# Altium schematic sheet sheet_top.SchDoc
size A4
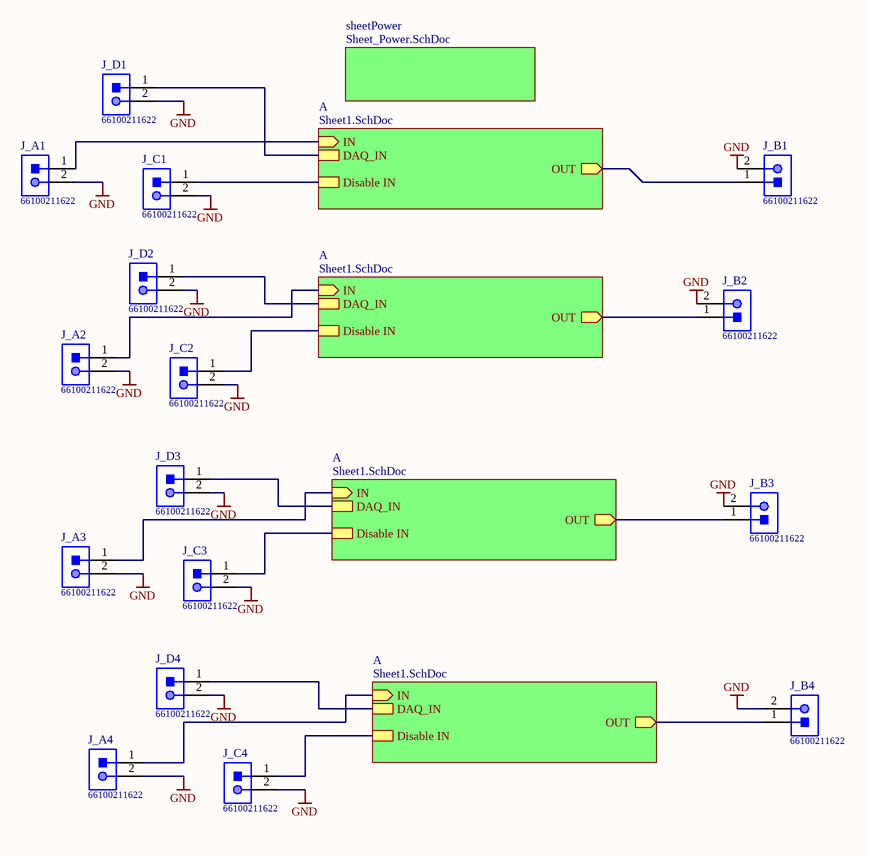
[diagram p0: sheet_top.SchDoc]

## Parts
J_A1  66100211622  [66100211622]
J_A2  66100211622  [66100211622]
J_A3  66100211622  [66100211622]
J_A4  66100211622  [66100211622]
J_B1  66100211622  [66100211622]
J_B2  66100211622  [66100211622]
J_B3  66100211622  [66100211622]
J_B4  66100211622  [66100211622]
J_C1  66100211622  [66100211622]
J_C2  66100211622  [66100211622]
J_C3  66100211622  [66100211622]
J_C4  66100211622  [66100211622]
J_D1  66100211622  [66100211622]
J_D2  66100211622  [66100211622]
J_D3  66100211622  [66100211622]
J_D4  66100211622  [66100211622]

## Sub-sheets
A = Sheet1.SchDoc: OUT (out), IN (in), Disable IN, DAQ_IN
A = Sheet1.SchDoc: OUT (out), IN (in), Disable IN, DAQ_IN
A = Sheet1.SchDoc: OUT (out), IN (in), Disable IN, DAQ_IN
A = Sheet1.SchDoc: OUT (out), IN (in), Disable IN, DAQ_IN
sheetPower = Sheet_Power.SchDoc: no entries

## Nets
GND: J_A1.2 J_A2.2 J_A3.2 J_A4.2 J_B1.2 J_B2.2 J_B3.2 J_B4.2 J_C1.2 J_C2.2 J_C3.2 J_C4.2 J_D1.2 J_D2.2 J_D3.2 J_D4.2
NetJ_A1_1: J_A1.1 ; sheet A/IN
NetJ_A2_1: J_A2.1 ; sheet A/IN
NetJ_A3_1: J_A3.1 ; sheet A/IN
NetJ_A4_1: J_A4.1 ; sheet A/IN
NetJ_B1_1: J_B1.1 ; sheet A/OUT
NetJ_B2_1: J_B2.1 ; sheet A/OUT
NetJ_B3_1: J_B3.1 ; sheet A/OUT
NetJ_B4_1: J_B4.1 ; sheet A/OUT
NetJ_C1_1: J_C1.1 ; sheet A/Disable IN
NetJ_C2_1: J_C2.1 ; sheet A/Disable IN
NetJ_C3_1: J_C3.1 ; sheet A/Disable IN
NetJ_C4_1: J_C4.1 ; sheet A/Disable IN
NetJ_D1_1: J_D1.1 ; sheet A/DAQ_IN
NetJ_D2_1: J_D2.1 ; sheet A/DAQ_IN
NetJ_D3_1: J_D3.1 ; sheet A/DAQ_IN
NetJ_D4_1: J_D4.1 ; sheet A/DAQ_IN

## Notes on the sheet
- Title
- Size:
- Modified:
- A4
- Project:
- Time:
- Sheet
- of
- Created:
- Author:
- Prj. #:
- Alfons Riedinger
- File:
- Revision:

## Library data of the parts
J_A1-J_A4 J_B1-J_B4 J_C1-J_C4 J_D1-J_D4 = CMP-001-0161-A.3: WR-WTB 2.54 mm Male Vertical Shrouded Header 2 Pins; Manufacturer: Wurth Electronics; Supplier Part Number: 732-14102-ND; PartNumber: 66100211622; Supplier: Digi-Key